# Altium schematic sheet Intermediate_LCL_Top_20230320.SchDoc
size A1; SheetNumber: 1; SheetTotal: 5
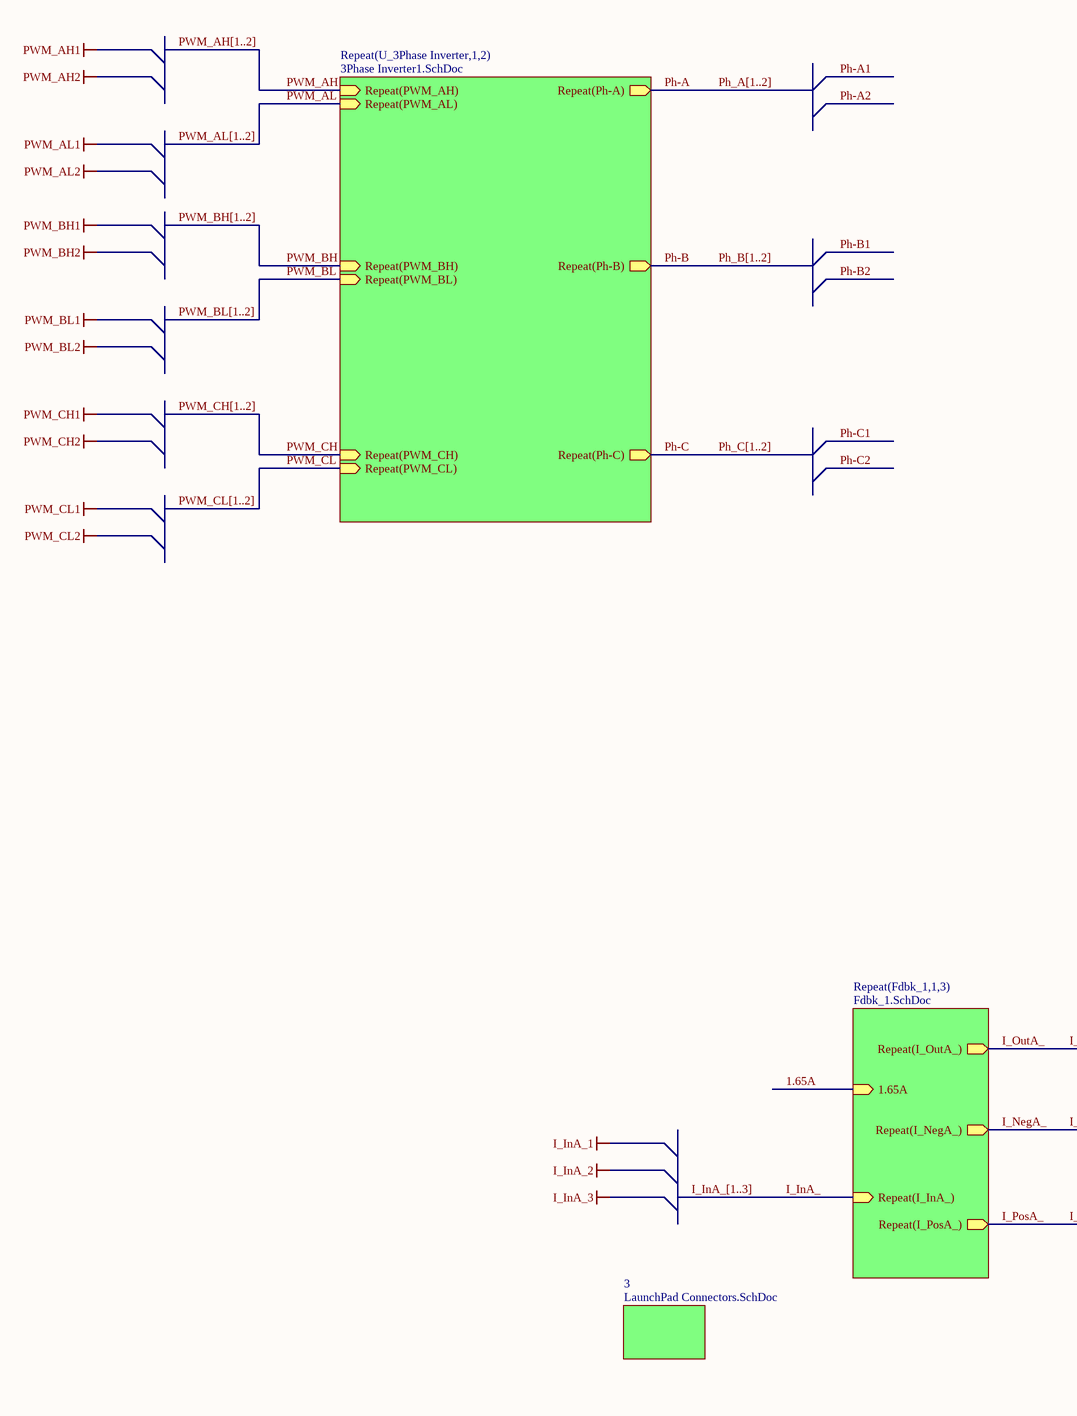
[diagram p0: Intermediate_LCL_Top_20230320.SchDoc, top left]
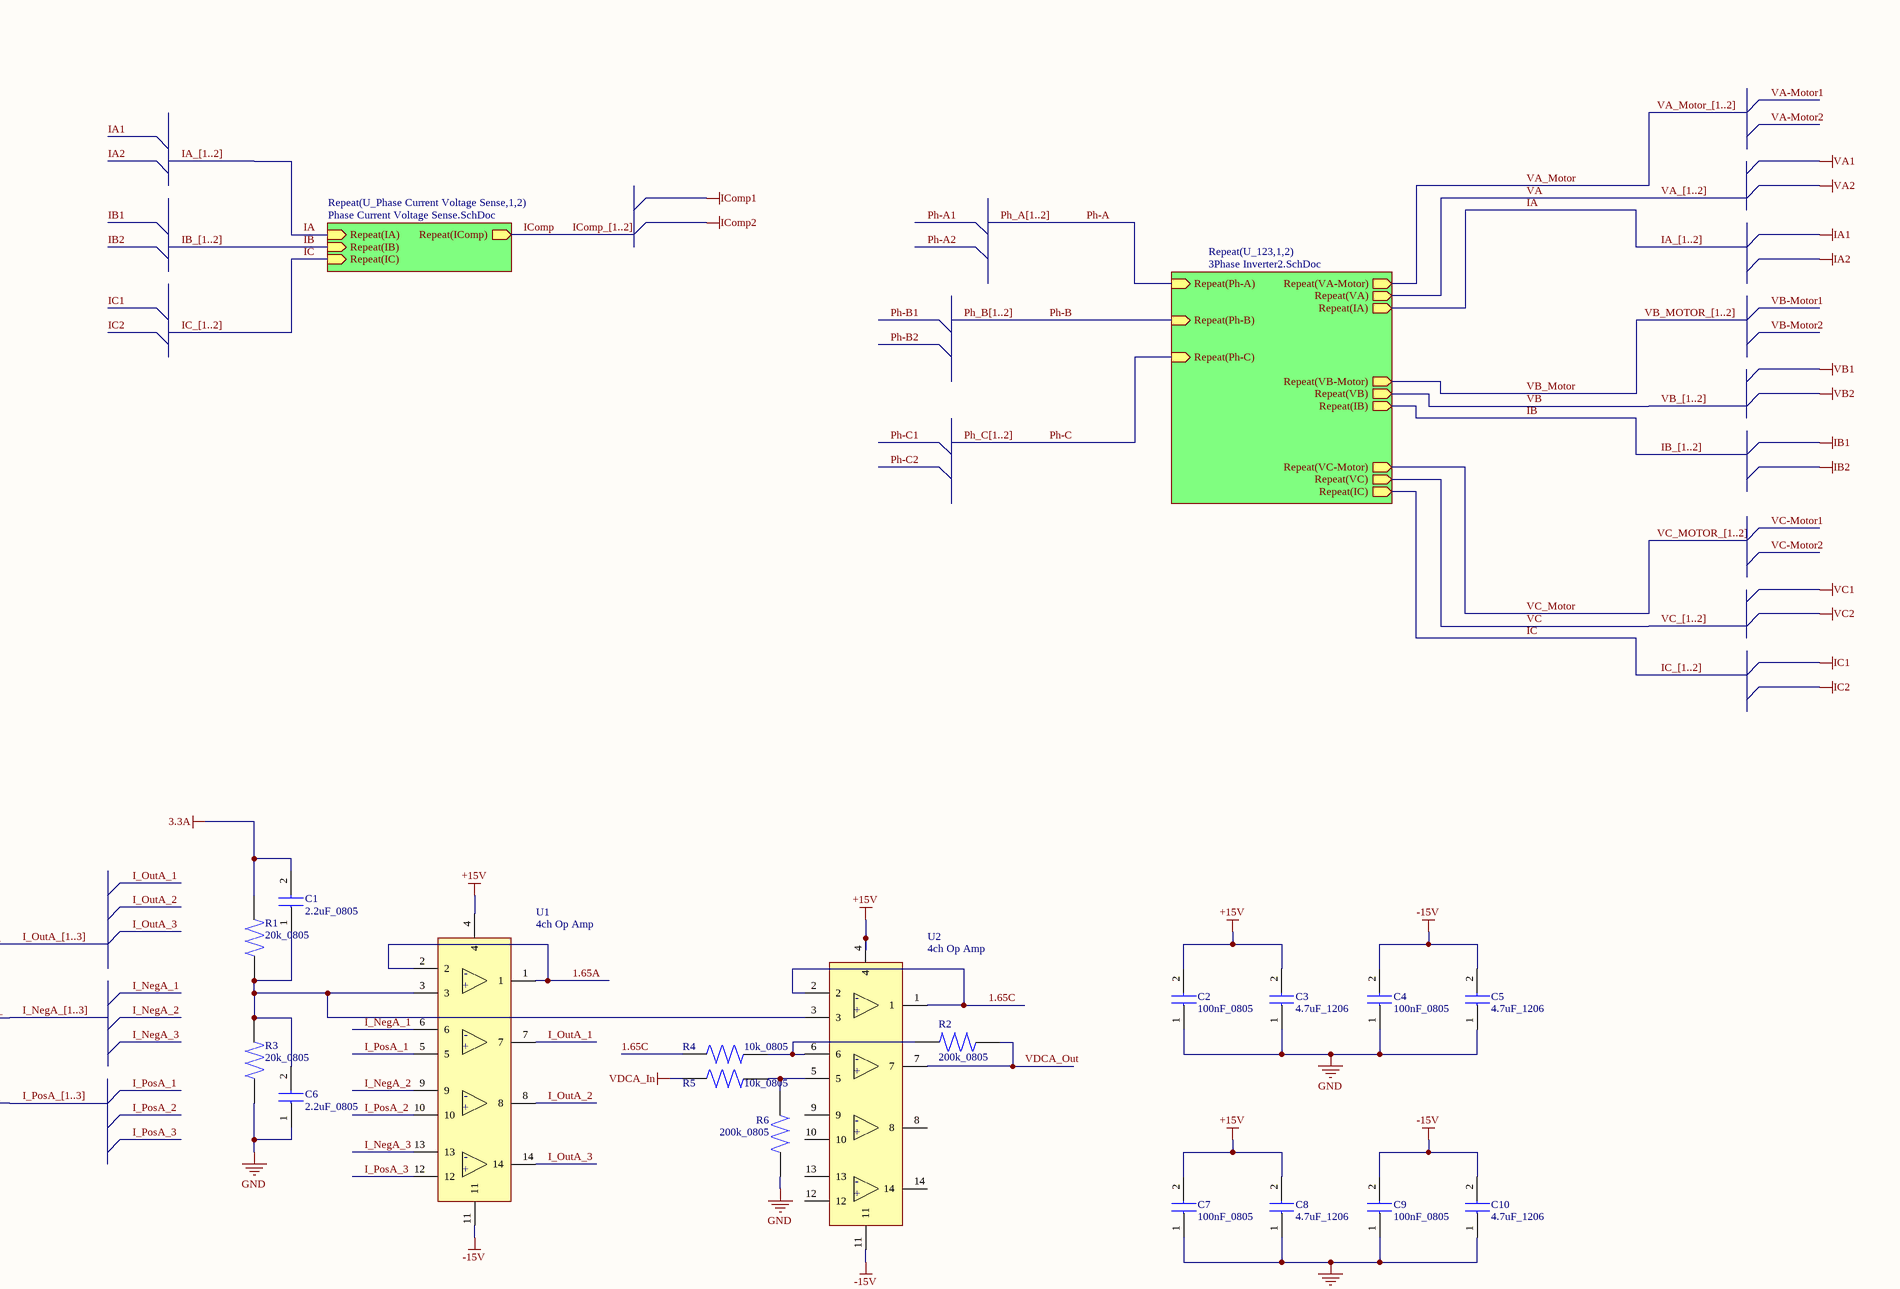
[diagram p1: Intermediate_LCL_Top_20230320.SchDoc, top right]
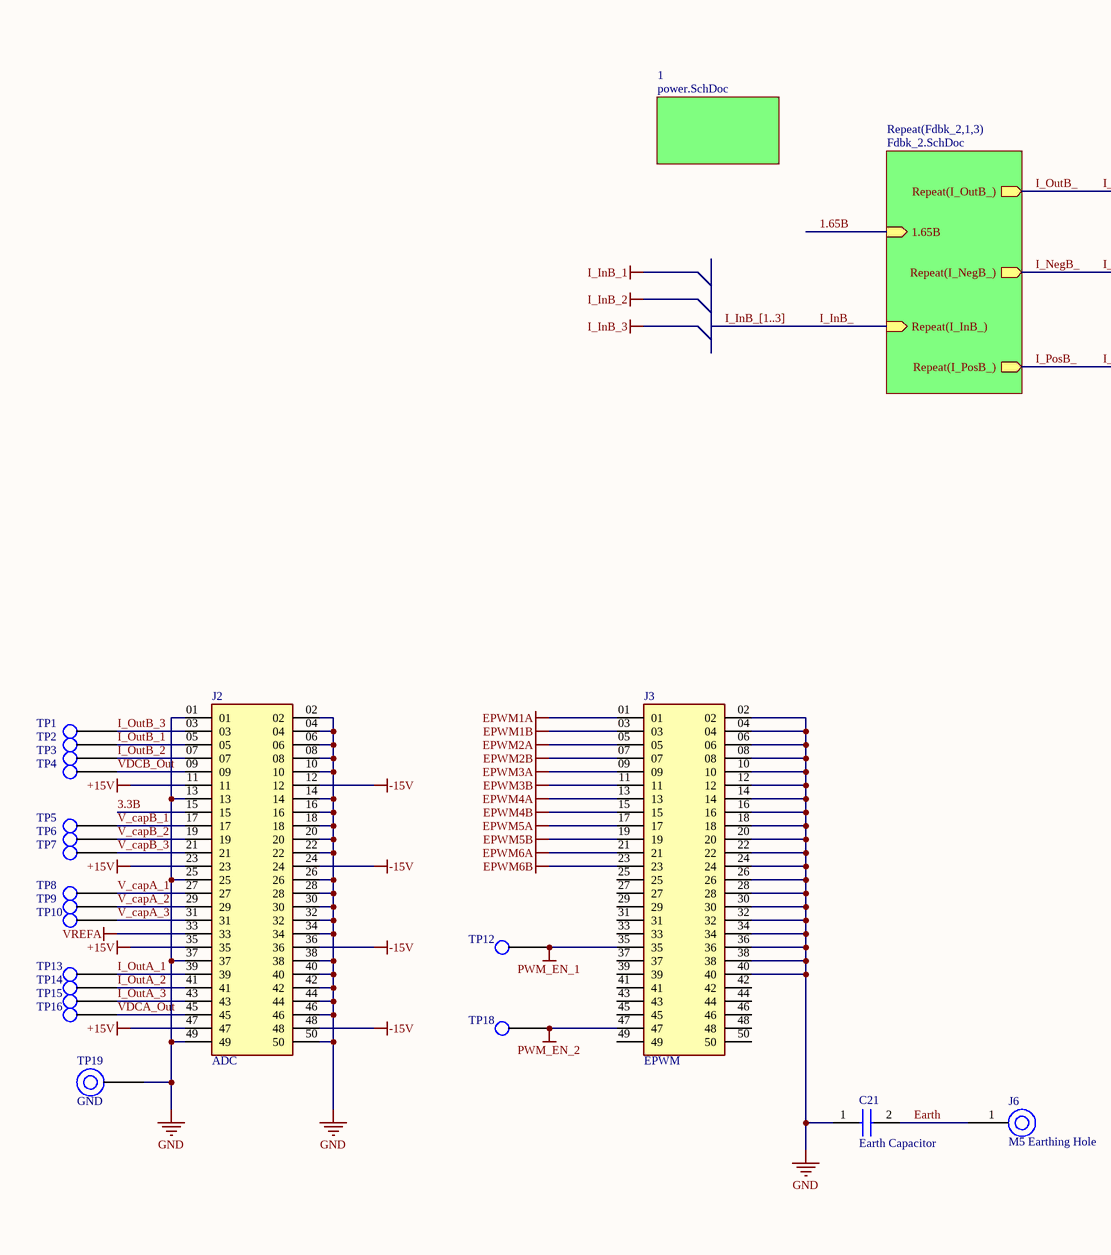
[diagram p2: Intermediate_LCL_Top_20230320.SchDoc, bottom left]
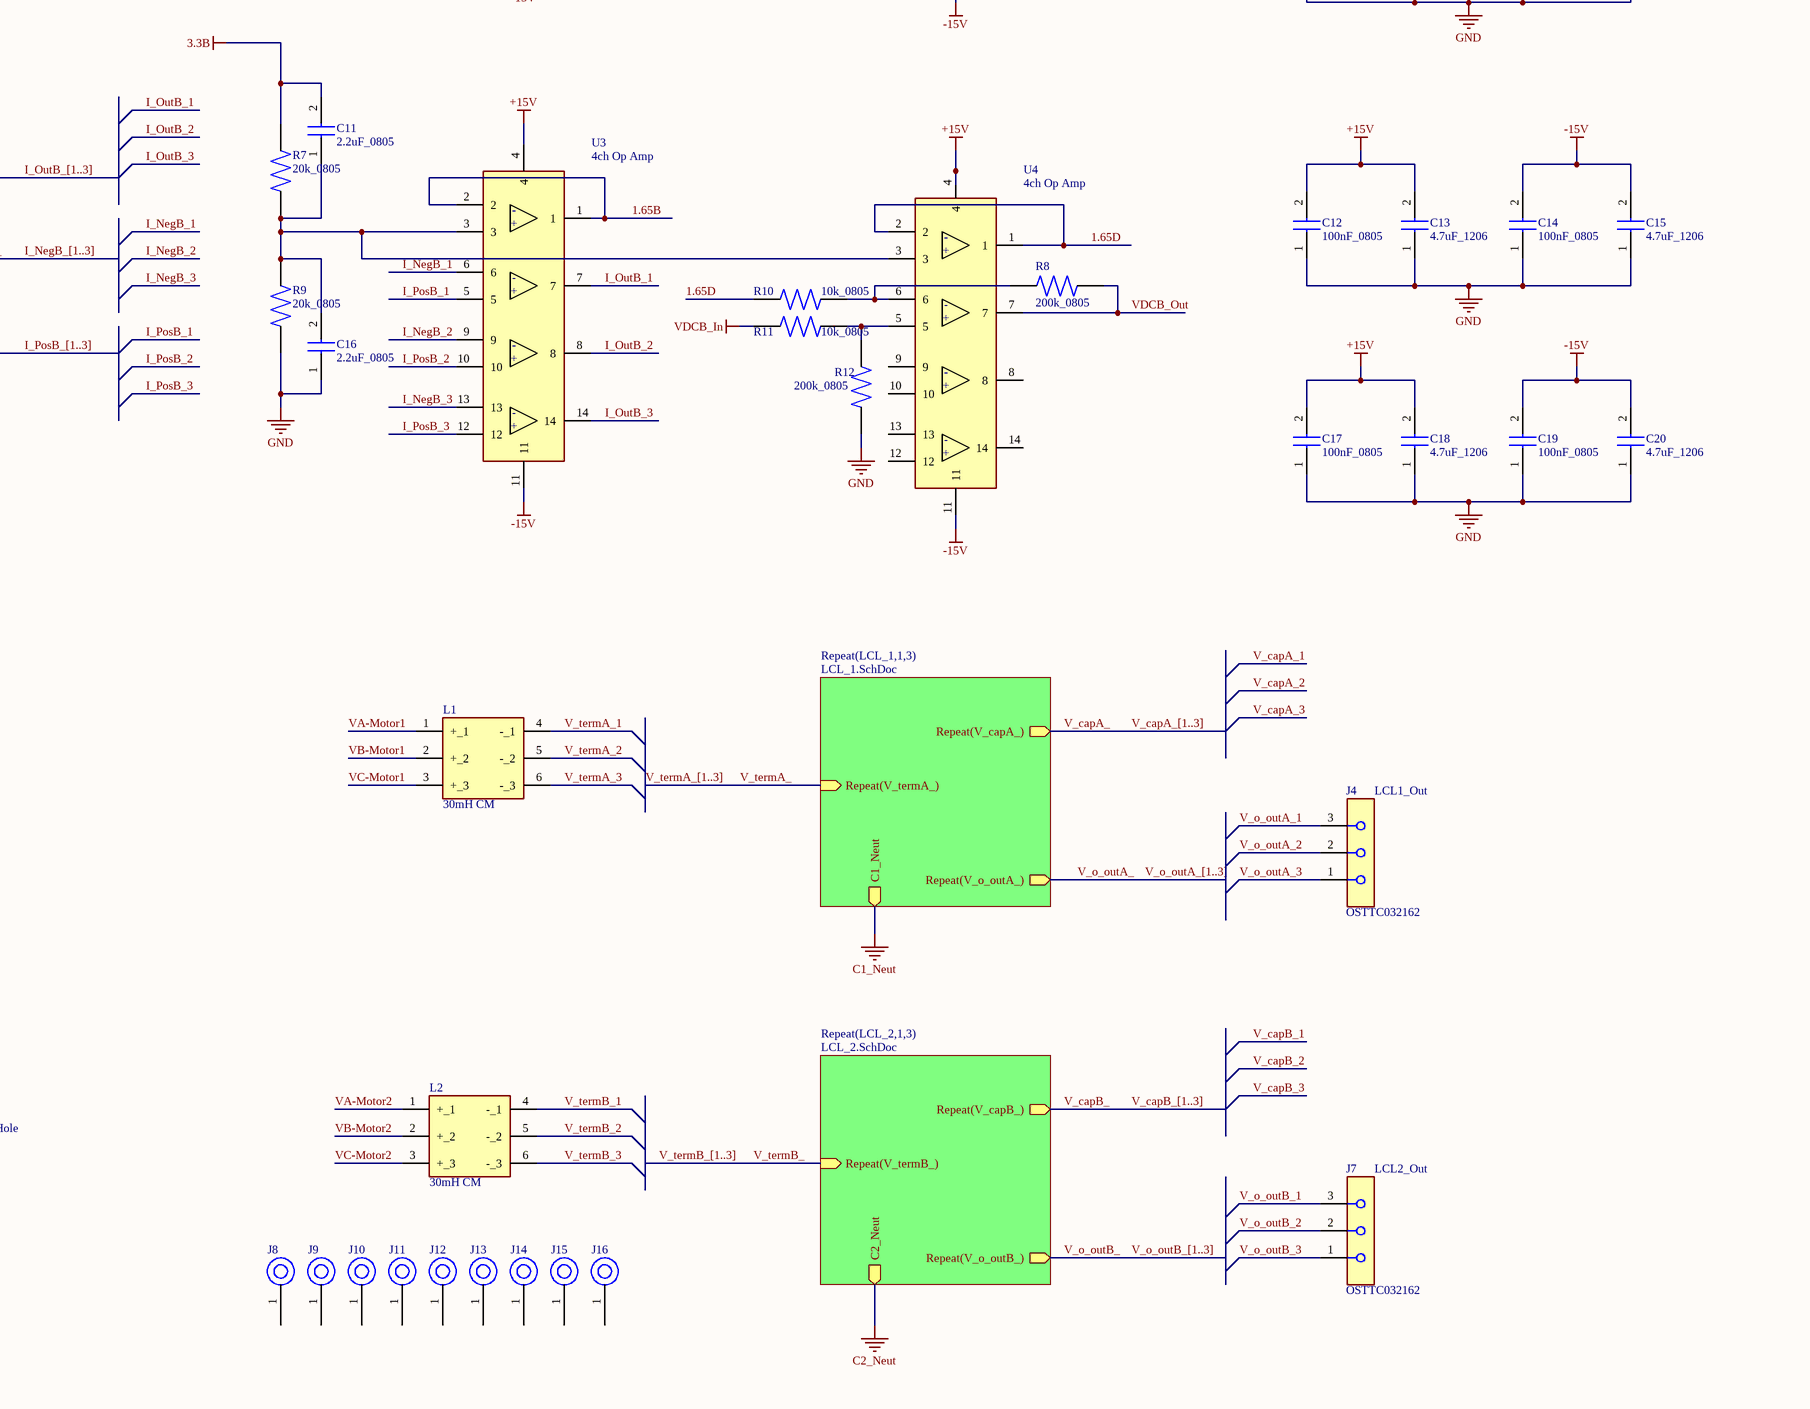
[diagram p3: Intermediate_LCL_Top_20230320.SchDoc, bottom right]

## Parts
C1  2.2uF_0805  [0805 Capacitor]
C2  100nF_0805  [0805 Capacitor]
C3  4.7uF_1206  [1206 Capacitor]
C4  100nF_0805  [0805 Capacitor]
C5  4.7uF_1206  [1206 Capacitor]
C6  2.2uF_0805  [0805 Capacitor]
C7  100nF_0805  [0805 Capacitor]
C8  4.7uF_1206  [1206 Capacitor]
C9  100nF_0805  [0805 Capacitor]
C10  4.7uF_1206  [1206 Capacitor]
C11  2.2uF_0805  [0805 Capacitor]
C12  100nF_0805  [0805 Capacitor]
C13  4.7uF_1206  [1206 Capacitor]
C14  100nF_0805  [0805 Capacitor]
C15  4.7uF_1206  [1206 Capacitor]
C16  2.2uF_0805  [0805 Capacitor]
C17  100nF_0805  [0805 Capacitor]
C18  4.7uF_1206  [1206 Capacitor]
C19  100nF_0805  [0805 Capacitor]
C20  4.7uF_1206  [1206 Capacitor]
C21  Earth Capacitor  [RAD-0.3]
J2  ADC  [SHF-125-01-L-D-RA]
J3  EPWM  [SHF-125-01-L-D-RA]
J4  LCL1_Out  Part Number: OSTTC032162  [3 Pin Terminal]
J6  M5 Earthing Hole  [M5 Earthing Hole]
J7  LCL2_Out  Part Number: OSTTC032162  [3 Pin Terminal]
J8  M5 Mounting Hole  [M5 Mounting Hole]  (value not drawn)
J9  M5 Mounting Hole  [M5 Mounting Hole]  (value not drawn)
J10  M5 Mounting Hole  [M5 Mounting Hole]  (value not drawn)
J11  M5 Mounting Hole  [M5 Mounting Hole]  (value not drawn)
J12  M5 Mounting Hole  [M5 Mounting Hole]  (value not drawn)
J13  M5 Mounting Hole  [M5 Mounting Hole]  (value not drawn)
J14  M5 Mounting Hole  [M5 Mounting Hole]  (value not drawn)
J15  M5 Mounting Hole  [M5 Mounting Hole]  (value not drawn)
J16  M5 Mounting Hole  [M5 Mounting Hole]  (value not drawn)
L1  30mH CM  [CM Choke Custom]
L2  30mH CM  [CM Choke Custom]
R1  20k_0805  [0805 Resistor]
R2  200k_0805  [0805 Resistor]
R3  20k_0805  [0805 Resistor]
R4  10k_0805  [0805 Resistor]
R5  10k_0805  [0805 Resistor]
R6  200k_0805  [0805 Resistor]
R7  20k_0805  [0805 Resistor]
R8  200k_0805  [0805 Resistor]
R9  20k_0805  [0805 Resistor]
R10  10k_0805  [0805 Resistor]
R11  10k_0805  [0805 Resistor]
R12  200k_0805  [0805 Resistor]
TP1  I3  [PCB 1.32mm TestPoint]  (value not drawn)
TP2  I1  [PCB 1.32mm TestPoint]  (value not drawn)
TP3  I2  [PCB 1.32mm TestPoint]  (value not drawn)
TP4  VDC  [PCB 1.32mm TestPoint]  (value not drawn)
TP5  VC_2A  [PCB 1.32mm TestPoint]  (value not drawn)
TP6  VC_2B  [PCB 1.32mm TestPoint]  (value not drawn)
TP7  VC_2C  [PCB 1.32mm TestPoint]  (value not drawn)
TP8  VC_1A  [PCB 1.32mm TestPoint]  (value not drawn)
TP9  VC_1B  [PCB 1.32mm TestPoint]  (value not drawn)
TP10  VC_1C  [PCB 1.32mm TestPoint]  (value not drawn)
TP12  PWMEN1  [PCB 1.32mm TestPoint]  (value not drawn)
TP13  I1  [PCB 1.32mm TestPoint]  (value not drawn)
TP14  I2  [PCB 1.32mm TestPoint]  (value not drawn)
TP15  I3  [PCB 1.32mm TestPoint]  (value not drawn)
TP16  VDC  [PCB 1.32mm TestPoint]  (value not drawn)
TP18  PWMEN2  [PCB 1.32mm TestPoint]  (value not drawn)
TP19  GND  [1.9mm Hole]
U1  4ch Op Amp  [SOIC-14]
U2  4ch Op Amp  [SOIC-14]
U3  4ch Op Amp  [SOIC-14]
U4  4ch Op Amp  [SOIC-14]

## Sub-sheets
1 = power.SchDoc: no entries
3 = LaunchPad Connectors.SchDoc: no entries
Repeat(Fdbk_1,1,3) = Fdbk_1.SchDoc: 1.65A (in), Repeat(I_InA_) (in), Repeat(I_PosA_) (out), Repeat(I_OutA_) (out), Repeat(I_NegA_) (out)
Repeat(Fdbk_2,1,3) = Fdbk_2.SchDoc: 1.65B (in), Repeat(I_InB_) (in), Repeat(I_PosB_) (out), Repeat(I_OutB_) (out), Repeat(I_NegB_) (out)
Repeat(LCL_1,1,3) = LCL_1.SchDoc: Repeat(V_termA_) (in), Repeat(V_o_outA_) (out), Repeat(V_capA_) (out), C1_Neut (out)
Repeat(LCL_2,1,3) = LCL_2.SchDoc: Repeat(V_termB_) (in), Repeat(V_o_outB_) (out), Repeat(V_capB_) (out), C2_Neut (out)
Repeat(U_3Phase Inverter,1,2) = 3Phase Inverter1.SchDoc: Repeat(PWM_AH) (in), Repeat(PWM_AL) (in), Repeat(Ph-A) (out), Repeat(PWM_BH) (in), Repeat(PWM_BL) (in), Repeat(PWM_CH) (in), Repeat(PWM_CL) (in), Repeat(Ph-B) (out), Repeat(Ph-C) (out)
Repeat(U_123,1,2) = 3Phase Inverter2.SchDoc: Repeat(Ph-A) (in), Repeat(VA-Motor) (out), Repeat(VA) (out), Repeat(IA) (out), Repeat(Ph-B) (in), Repeat(Ph-C) (in), Repeat(VB-Motor) (out), Repeat(VB) (out), Repeat(IB) (out), Repeat(VC-Motor) (out), Repeat(VC) (out), Repeat(IC) (out)
Repeat(U_Phase Current Voltage Sense,1,2) = Phase Current Voltage Sense.SchDoc: Repeat(IA) (in), Repeat(IB) (in), Repeat(IC) (in), Repeat(IComp) (out)

## Nets
3.3A: C1.2 R1.2
3.3B: C11.2 J2.15 R7.2
+15V: C2.2 C3.2 C7.2 C8.2 C12.2 C13.2 C17.2 C18.2 J2.11 J2.23 J2.35 J2.47 U1.4 U2.4 U3.4 U4.4
-15V: C4.2 C5.2 C9.2 C10.2 C14.2 C15.2 C19.2 C20.2 J2.12 J2.24 J2.36 J2.48 U1.11 U2.11 U3.11 U4.11
C1_Neut: sheet Repeat(LCL_1,1,3)/C1_Neut
C2_Neut: sheet Repeat(LCL_2,1,3)/C2_Neut
EPWM1A: J3.01
EPWM1B: J3.03
EPWM2A: J3.05
EPWM2B: J3.07
EPWM3A: J3.09
EPWM3B: J3.11
EPWM4A: J3.13
EPWM4B: J3.15
EPWM5A: J3.17
EPWM5B: J3.19
EPWM6A: J3.21
EPWM6B: J3.23
GND: C2.1 C3.1 C4.1 C5.1 C6.1 C7.1 C8.1 C9.1 C10.1 C12.1 C13.1 C14.1 C15.1 C16.1 C17.1 C18.1 C19.1 C20.1 C21.1 J2.01 J2.02 J2.04 J2.06 J2.08 J2.10 J2.13 J2.14 J2.16 J2.18 J2.20 J2.22 J2.25 J2.26 J2.28 J2.30 J2.32 J2.34 J2.37 J2.38 J2.40 J2.42 J2.44 J2.46 J2.49 J2.50 J3.02 J3.04 J3.06 J3.08 J3.10 J3.12 J3.14 J3.16 J3.18 J3.20 J3.22 J3.24 J3.26 J3.28 J3.30 J3.32 J3.34 J3.36 J3.38 J3.40 R3.1 R6.2 R9.1 R12.2 TP19.1
PWM_EN_1: J3.35 TP12.1
PWM_EN_2: J3.47 TP18.1
VDCA_In: R5.1
VDCB_In: R11.1
VREFA: J2.33
1.65A: U1.1 U1.2 ; sheet Repeat(Fdbk_1,1,3)/1.65A
1.65B: U3.1 U3.2 ; sheet Repeat(Fdbk_2,1,3)/1.65B
1.65C: R4.1 U2.1 U2.2
1.65D: R10.1 U4.1 U4.2
Earth: C21.2 J6.1
I_InA_: sheet Repeat(Fdbk_1,1,3)/Repeat(I_InA_)
I_InB_: sheet Repeat(Fdbk_2,1,3)/Repeat(I_InB_)
I_NegA_: sheet Repeat(Fdbk_1,1,3)/Repeat(I_NegA_)
I_NegA_1: U1.6
I_NegA_2: U1.9
I_NegA_3: U1.13
I_NegB_: sheet Repeat(Fdbk_2,1,3)/Repeat(I_NegB_)
I_NegB_1: U3.6
I_NegB_2: U3.9
I_NegB_3: U3.13
I_OutA_: sheet Repeat(Fdbk_1,1,3)/Repeat(I_OutA_)
I_OutA_1: J2.39 TP13.1 U1.7
I_OutA_2: J2.41 TP14.1 U1.8
I_OutA_3: J2.43 TP15.1 U1.14
I_OutB_: sheet Repeat(Fdbk_2,1,3)/Repeat(I_OutB_)
I_OutB_1: J2.05 TP2.1 U3.7
I_OutB_2: J2.07 TP3.1 U3.8
I_OutB_3: J2.03 TP1.1 U3.14
I_PosA_: sheet Repeat(Fdbk_1,1,3)/Repeat(I_PosA_)
I_PosA_1: U1.5
I_PosA_2: U1.10
I_PosA_3: U1.12
I_PosB_: sheet Repeat(Fdbk_2,1,3)/Repeat(I_PosB_)
I_PosB_1: U3.5
I_PosB_2: U3.10
I_PosB_3: U3.12
IA: sheet Repeat(U_123,1,2)/Repeat(IA), sheet Repeat(U_Phase Current Voltage Sense,1,2)/Repeat(IA)
IB: sheet Repeat(U_123,1,2)/Repeat(IB), sheet Repeat(U_Phase Current Voltage Sense,1,2)/Repeat(IB)
IC: sheet Repeat(U_123,1,2)/Repeat(IC), sheet Repeat(U_Phase Current Voltage Sense,1,2)/Repeat(IC)
IComp: sheet Repeat(U_Phase Current Voltage Sense,1,2)/Repeat(IComp)
Ph-A: sheet Repeat(U_3Phase Inverter,1,2)/Repeat(Ph-A), sheet Repeat(U_123,1,2)/Repeat(Ph-A)
Ph-B: sheet Repeat(U_3Phase Inverter,1,2)/Repeat(Ph-B), sheet Repeat(U_123,1,2)/Repeat(Ph-B)
Ph-C: sheet Repeat(U_3Phase Inverter,1,2)/Repeat(Ph-C), sheet Repeat(U_123,1,2)/Repeat(Ph-C)
PWM_AH: sheet Repeat(U_3Phase Inverter,1,2)/Repeat(PWM_AH)
PWM_AL: sheet Repeat(U_3Phase Inverter,1,2)/Repeat(PWM_AL)
PWM_BH: sheet Repeat(U_3Phase Inverter,1,2)/Repeat(PWM_BH)
PWM_BL: sheet Repeat(U_3Phase Inverter,1,2)/Repeat(PWM_BL)
PWM_CH: sheet Repeat(U_3Phase Inverter,1,2)/Repeat(PWM_CH)
PWM_CL: sheet Repeat(U_3Phase Inverter,1,2)/Repeat(PWM_CL)
V_capA_: sheet Repeat(LCL_1,1,3)/Repeat(V_capA_)
V_capA_1: J2.27 TP8.1
V_capA_2: J2.29 TP9.1
V_capA_3: J2.31 TP10.1
V_capB_: sheet Repeat(LCL_2,1,3)/Repeat(V_capB_)
V_capB_1: J2.17 TP5.1
V_capB_2: J2.19 TP6.1
V_capB_3: J2.21 TP7.1
V_o_outA_: sheet Repeat(LCL_1,1,3)/Repeat(V_o_outA_)
V_o_outA_1: J4.3
V_o_outA_2: J4.2
V_o_outA_3: J4.1
V_o_outB_: sheet Repeat(LCL_2,1,3)/Repeat(V_o_outB_)
V_o_outB_1: J7.3
V_o_outB_2: J7.2
V_o_outB_3: J7.1
V_termA_: sheet Repeat(LCL_1,1,3)/Repeat(V_termA_)
V_termA_1: L1.4(-_1)
V_termA_2: L1.5(-_2)
V_termA_3: L1.6(-_3)
V_termB_: sheet Repeat(LCL_2,1,3)/Repeat(V_termB_)
V_termB_1: L2.4(-_1)
V_termB_2: L2.5(-_2)
V_termB_3: L2.6(-_3)
VA: sheet Repeat(U_123,1,2)/Repeat(VA)
VA-Motor1: L1.1(+_1)
VA-Motor2: L2.1(+_1)
VA_Motor: sheet Repeat(U_123,1,2)/Repeat(VA-Motor)
VB: sheet Repeat(U_123,1,2)/Repeat(VB)
VB-Motor1: L1.2(+_2)
VB-Motor2: L2.2(+_2)
VB_Motor: sheet Repeat(U_123,1,2)/Repeat(VB-Motor)
VC: sheet Repeat(U_123,1,2)/Repeat(VC)
VC-Motor1: L1.3(+_3)
VC-Motor2: L2.3(+_3)
VC_Motor: sheet Repeat(U_123,1,2)/Repeat(VC-Motor)
VDCA_Out: J2.45 R2.1 TP16.1 U2.7
VDCB_Out: J2.09 R8.1 TP4.1 U4.7
NetC1_1: C1.1 C6.2 R1.1 R3.2 U1.3 U2.3
NetC11_1: C11.1 C16.2 R7.1 R9.2 U3.3 U4.3
NetR2_2: R2.2 R4.2 U2.6
NetR5_2: R5.2 R6.1 U2.5
NetR8_2: R8.2 R10.2 U4.6
NetR11_2: R11.2 R12.1 U4.5

Not connected (* = marked no-connect by the designer): J3 25 27 29 31 33 37 39 41 42 43 44 45 46 48 49 50; J8 1; J9 1; J10 1; J11 1; J12 1; J13 1; J14 1; J15 1; J16 1; U2 8 9 10 12 13 14; U4 8 9 10 12 13 14

## Buses and harness runs
bus I_InA_[1..3]
bus I_InB_[1..3]
bus I_NegA_[1..3]
bus I_NegB_[1..3]
bus I_OutA_[1..3]
bus I_OutB_[1..3]
bus I_PosA_[1..3]
bus I_PosB_[1..3]
bus IA_[1..2]
bus IB_[1..2]
bus IC_[1..2]
bus IComp_[1..2]
bus Ph_A[1..2]
bus Ph_B[1..2]
bus Ph_C[1..2]
bus PWM_AH[1..2]
bus PWM_AL[1..2]
bus PWM_BH[1..2]
bus PWM_BL[1..2]
bus PWM_CH[1..2]
bus PWM_CL[1..2]
bus V_capA_[1..3]
bus V_capB_[1..3]
bus V_o_outA_[1..3]
bus V_o_outB_[1..3]
bus V_termA_[1..3]
bus V_termB_[1..3]
bus VA_[1..2]
bus VA_Motor_[1..2]
bus VB_[1..2]
bus VB_MOTOR_[1..2]
bus VC_[1..2]
bus VC_MOTOR_[1..2]

## Notes on the sheet
- (in symbol TL074D) -; +

## Library data of the parts
C1 C6 C11 C16 = C2012X5R1H225K125AB: SMD Multilayer Ceramic Capacitor, 2.2 µF, 50 V, 0805 [2012 Metric], ± 10%, X5R, C
C2 C4 C7 C9 C12 C14 C17 C19 = C0805C104J5RACTU: SMD Multilayer Ceramic Capacitor, 0.1 µF, 50 V, 0805 [2012 Metric], ± 5%, X7R, C Series KEMET
C3 C5 C8 C10 C13 C15 C18 C20 = C3216X7R1H475K160AC: SMD Multilayer Ceramic Capacitor, 4.7 µF, 50 V, 1206 [3216 Metric], ± 10%, X7R, C; MP: C1206C120J5GACTU; Package: None; Price: None; Value: *; Availability: Unavailable
C21 = 102_Y: Y Earth Capacitor; MP: C1206C120J5GACTU; Package: None; Price: None; Value: *; Availability: Unavailable
J2 J3 = SHF-125-01-L-D-RA: 50-Pin Simplus Connector; MF: Samtec; MP: SHF-125-01-L-D-RA; Package: None; Price: None; Availability: Unavailable; Value: *
J4 J7 = 3PinTerminal: 3 Position Terminal Block 5.08mm; Manufacturer: On Shore Technology; Voltage: 300V; Is Female: yes; helpURL: https://upverter.com/upn/revision/2b80058b23306b34/; ComponentLink2Description: Datasheet; Temperature: -30°C to +105°C; Package: HDR03; Supplier 2: Mouser; Price: 0.382016875697; Supplier 1: Digi-Key; ComponentLink1URL: https://upverter.com/upn/revision/2b80058b23306b34/; Supplier Part Number 1: ED2610-ND; ComponentLink1Description: Upverter; ComponentLink2URL: https://upverter.com/datasheet/d9a5d2e095ec14efdc364e45047c257fc4ca76eb.pdf; RoHS: TRUE; Temperature Range High: +105°C; Digikey Description: CONN TERM BLOCK 5.08MM VERT 3POS PCB; Digikey Part Number: ED2610-ND; Lead Free: yes; Temperature Range Low: -30°C
L1 L2 = 30mH Custom CM Choke: Manufacturer_Name: Wurth Elektronik; Manufacturer_Part_Number: 744839029220; Datasheet Link: https://componentsearchengine.com//744839029220.pdf; Height: 39mm; Mouser Part Number: 710-744839029220; Mouser Price/Stock: https://www.mouser.co.uk/ProductDetail/Wurth-Elektronik/744839029220?qs=MoCBKJu1Jj15mDhjF%2F4U%252Bg%3D%3D
R1 R3 R7 R9 = CRCW080520K0FKEA: SMD Chip Resistor, 20 kohm, ± 1%, 125 mW, 0805 [2012 Metric], Thick Film, General Purpose; MF: Bourns; MP: CRE2512-FZ-R007E-3; Mouser-Purchase-URL: https://snapeda.com/shop?store=Mouser&id=836123; Price: None; Package: 6432 Stackpole; Value: *; SnapEDA_Link: https://www.snapeda.com/parts/CRE2512-FZ-R007E-3/Bourns/view-part/836123/?ref=snap; DigiKey-Purchase-URL: https://snapeda.com/shop?store=DigiKey&id=836123; Availability: Good
R2 R6 R8 R12 = CRCW0805200KFKEA: SMD Chip Resistor, 200 kohm, ± 1%, 125 mW, 0805 [2012 Metric], Thick Film, General Purpose; MF: Bourns; MP: CRE2512-FZ-R007E-3; Mouser-Purchase-URL: https://snapeda.com/shop?store=Mouser&id=836123; Price: None; Package: 6432 Stackpole; Value: *; SnapEDA_Link: https://www.snapeda.com/parts/CRE2512-FZ-R007E-3/Bourns/view-part/836123/?ref=snap; DigiKey-Purchase-URL: https://snapeda.com/shop?store=DigiKey&id=836123; Availability: Good
R4 R5 R10 R11 = CRCW080510K0FKEA: SMD Chip Resistor, 10 kohm, ± 1%, 125 mW, 0805 [2012 Metric], Thick Film, General Purpose; MF: Bourns; MP: CRE2512-FZ-R007E-3; Mouser-Purchase-URL: https://snapeda.com/shop?store=Mouser&id=836123; Price: None; Package: 6432 Stackpole; Value: *; SnapEDA_Link: https://www.snapeda.com/parts/CRE2512-FZ-R007E-3/Bourns/view-part/836123/?ref=snap; DigiKey-Purchase-URL: https://snapeda.com/shop?store=DigiKey&id=836123; Availability: Good
TP1-TP10 TP12-TP16 TP18 = PCBTestpoint: 20-313143 PCB Test Point, White, Through Hole Mount, 1.32 mm, Phosphor Bronze, Tin Plated Contacts
TP19 = GroundTestPoint: H2182-01 PCB Test Point, PCB Mount, 1.9 mm, Brass, Tin Plated Contacts
U1-U4 = TL074D: Quad, 30-V, 3-MHz, high slew rate (13-V/µs), In to V+, JFET-input op amp